# Altium schematic sheet STM32.SchDoc
size A4
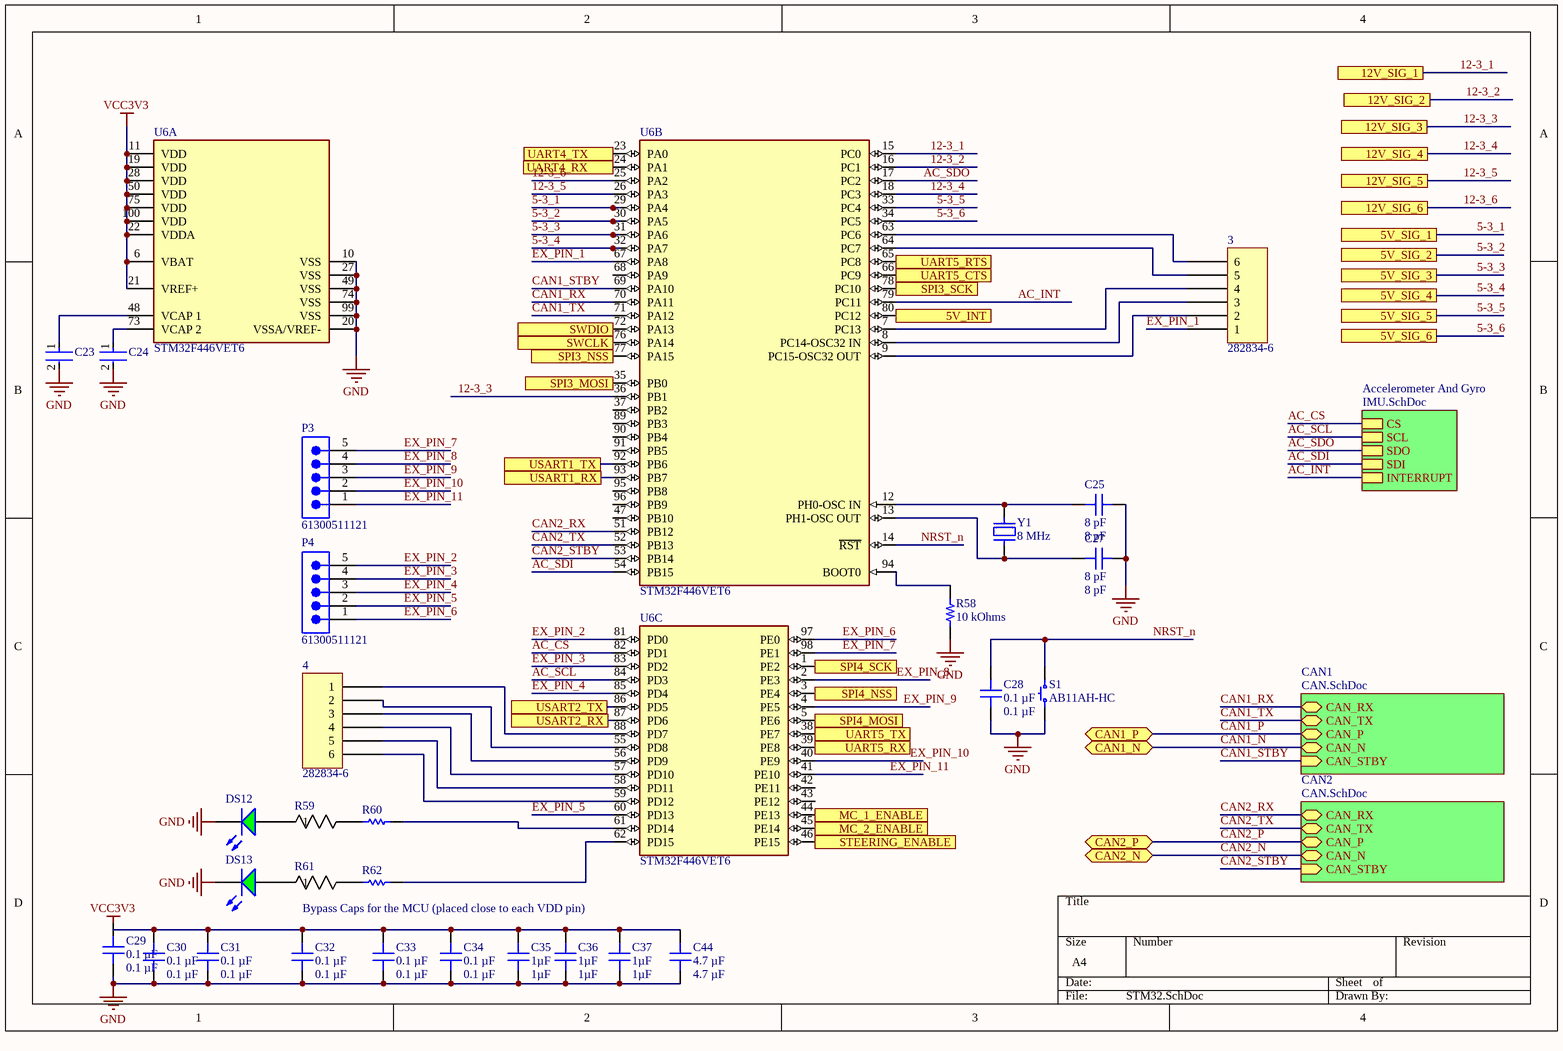
[diagram p0: STM32.SchDoc]

## Parts
3  282834-6  [TE 282834-6]
4  282834-6  [TE 282834-6]
C23  GRM188R71A225KE15D  [FP-GRM188-0_1-e0_2_0_5-MFG]  (value not drawn)
C24  GRM188R71A225KE15D  [FP-GRM188-0_1-e0_2_0_5-MFG]  (value not drawn)
C25  8 pF  [CAP 0805_2012]
C27  8 pF  [CAP 0805_2012]
C28  0.1 µF  [CAP 0805_2012]
C29  0.1 µF  [CAP 0805_2012]
C30  0.1 µF  [CAP 0805_2012]
C31  0.1 µF  [CAP 0805_2012]
C32  0.1 µF  [CAP 0805_2012]
C33  0.1 µF  [CAP 0805_2012]
C34  0.1 µF  [CAP 0805_2012]
C35  1µF  [CAP 0805_2012]
C36  1µF  [CAP 0805_2012]
C37  1µF  [CAP 0805_2012]
C44  4.7 µF  [CAP 0805_2012]
DS12  HLMP-4740  [AVAG-HLMP-4740]  (value not drawn)
DS13  HLMP-4740  [AVAG-HLMP-4740]  (value not drawn)
P3  61300511121  [61300511121]
P4  61300511121  [61300511121]
R58  10 kOhms  [RES 0805_2012]
R59  AC01000005000JA100  [RES_AC01_VIS]  (value not drawn)
R60  RC0805FR-071KL  [RESC2013X60X35ML10T20]  (value not drawn)
R61  AC01000005000JA100  [RES_AC01_VIS]  (value not drawn)
R62  RC0805FR-071KL  [RESC2013X60X35ML10T20]  (value not drawn)
S1  AB11AH-HC  [NKK AB11AH-HC]
U6  STM32F446VET6  [FP-LQFP100-1L-MFG]  (parts A,B,C of 3)
Y1  8 MHz  [ABRACON ABLS]

## Sub-sheets
Accelerometer And Gyro = IMU.SchDoc: CS, SCL, SDO, SDI, INTERRUPT
CAN1 = CAN.SchDoc: CAN_RX (bidir), CAN_TX (bidir), CAN_STBY (in), CAN_P (bidir), CAN_N (bidir)
CAN2 = CAN.SchDoc: CAN_RX (bidir), CAN_TX (bidir), CAN_STBY (in), CAN_P (bidir), CAN_N (bidir)

## Ports
5V_INT, 5V_SIG_1, 5V_SIG_2, 5V_SIG_3, 5V_SIG_4, 5V_SIG_5, 5V_SIG_6, 12V_SIG_1, 12V_SIG_2, 12V_SIG_3, 12V_SIG_4, 12V_SIG_5, 12V_SIG_6, CAN1_N (bidir), CAN1_P (bidir), CAN2_N (bidir), CAN2_P (bidir), MC_1_ENABLE, MC_2_ENABLE, SPI3_MOSI, SPI3_NSS, SPI3_SCK, SPI4_MOSI, SPI4_NSS, SPI4_SCK, STEERING_ENABLE, SWCLK, SWDIO, UART4_RX, UART4_TX, UART5_CTS, UART5_RTS, UART5_RX, UART5_TX, USART1_RX, USART1_TX, USART2_RX, USART2_TX

## Nets
GND: C23.2 C24.2 C25.2 C27.2 C28.1 C29.1 C30.1 C31.1 C32.1 C33.1 C34.1 C35.1 C36.1 C37.1 C44.1 DS12.2(K) DS13.2(K) R58.1 S1.1 U6.10(VSS) U6.20(VSSA/VREF-) U6.27(VSS) U6.49(VSS) U6.74(VSS) U6.99(VSS)
VCC3V3: C30.2 C31.2 C32.2 C33.2 C34.2 C35.2 C36.2 C37.2 C44.2 U6.6(VBAT) U6.11(VDD) U6.19(VDD) U6.21(VREF+) U6.22(VDDA) U6.28(VDD) U6.50(VDD) U6.75(VDD) U6.100(VDD)
5-3_1: U6.29(PA4) ; port 5V_SIG_1
5-3_2: U6.30(PA5) ; port 5V_SIG_2
5-3_3: U6.31(PA6) ; port 5V_SIG_3
5-3_4: U6.32(PA7) ; port 5V_SIG_4
5-3_5: U6.33(PC4) ; port 5V_SIG_5
5-3_6: U6.34(PC5) ; port 5V_SIG_6
5V_INT: U6.80(PC12) ; port 5V_INT
12-3_1: U6.15(PC0) ; port 12V_SIG_1
12-3_2: U6.16(PC1) ; port 12V_SIG_2
12-3_3: U6.36(PB1) ; port 12V_SIG_3
12-3_4: U6.18(PC3) ; port 12V_SIG_4
12-3_5: U6.26(PA3) ; port 12V_SIG_5
12-3_6: U6.25(PA2) ; port 12V_SIG_6
AC_CS: U6.82(PD1) ; sheet Accelerometer And Gyro/CS
AC_INT: U6.79(PC11) ; sheet Accelerometer And Gyro/INTERRUPT
AC_SCL: U6.84(PD3) ; sheet Accelerometer And Gyro/SCL
AC_SDI: U6.54(PB15) ; sheet Accelerometer And Gyro/SDI
AC_SDO: U6.17(PC2) ; sheet Accelerometer And Gyro/SDO
CAN1_N: port CAN1_N, sheet CAN1/CAN_N
CAN1_P: port CAN1_P, sheet CAN1/CAN_P
CAN1_RX: U6.70(PA11) ; sheet CAN1/CAN_RX
CAN1_STBY: U6.69(PA10) ; sheet CAN1/CAN_STBY
CAN1_TX: U6.71(PA12) ; sheet CAN1/CAN_TX
CAN2_N: port CAN2_N, sheet CAN2/CAN_N
CAN2_P: port CAN2_P, sheet CAN2/CAN_P
CAN2_RX: U6.51(PB12) ; sheet CAN2/CAN_RX
CAN2_STBY: U6.53(PB14) ; sheet CAN2/CAN_STBY
CAN2_TX: U6.52(PB13) ; sheet CAN2/CAN_TX
EX_PIN_1: 3.1 U6.67(PA8)
EX_PIN_2: P4.5 U6.81(PD0)
EX_PIN_3: P4.4 U6.83(PD2)
EX_PIN_4: P4.3 U6.85(PD4)
EX_PIN_5: P4.2 U6.60(PD13)
EX_PIN_6: P4.1 U6.97(PE0)
EX_PIN_7: P3.5 U6.98(PE1)
EX_PIN_8: P3.4 U6.2(PE3)
EX_PIN_9: P3.3 U6.4(PE5)
EX_PIN_10: P3.2 U6.40(PE9)
EX_PIN_11: P3.1 U6.41(PE10)
MC_1_ENABLE: U6.44(PE13) ; port MC_1_ENABLE
MC_2_ENABLE: U6.45(PE14) ; port MC_2_ENABLE
NRST_n: C28.2 S1.2 U6.14(~{RST})
SPI3_MOSI: U6.35(PB0) ; port SPI3_MOSI
SPI3_NSS: U6.77(PA15) ; port SPI3_NSS
SPI3_SCK: U6.78(PC10) ; port SPI3_SCK
SPI4_MOSI: U6.5(PE6) ; port SPI4_MOSI
SPI4_NSS: U6.3(PE4) ; port SPI4_NSS
SPI4_SCK: U6.1(PE2) ; port SPI4_SCK
STEERING_ENABLE: U6.46(PE15) ; port STEERING_ENABLE
SWCLK: U6.76(PA14) ; port SWCLK
SWDIO: U6.72(PA13) ; port SWDIO
UART4_RX: U6.24(PA1) ; port UART4_RX
UART4_TX: U6.23(PA0) ; port UART4_TX
UART5_CTS: U6.66(PC9) ; port UART5_CTS
UART5_RTS: U6.65(PC8) ; port UART5_RTS
UART5_RX: U6.39(PE8) ; port UART5_RX
UART5_TX: U6.38(PE7) ; port UART5_TX
USART1_RX: U6.93(PB7) ; port USART1_RX
USART1_TX: U6.92(PB6) ; port USART1_TX
USART2_RX: U6.87(PD6) ; port USART2_RX
USART2_TX: U6.86(PD5) ; port USART2_TX
Net3_2: 3.2 U6.9(PC15-OSC32_OUT)
Net3_3: 3.3 U6.8(PC14-OSC32_IN)
Net3_4: 3.4 U6.7(PC13)
Net3_5: 3.5 U6.64(PC7)
Net3_6: 3.6 U6.63(PC6)
Net4_1: 4.1 U6.88(PD7)
Net4_2: 4.2 U6.55(PD8)
Net4_3: 4.3 U6.56(PD9)
Net4_4: 4.4 U6.57(PD10)
Net4_5: 4.5 U6.58(PD11)
Net4_6: 4.6 U6.59(PD12)
NetC23_1: C23.1 U6.48(VCAP_1)
NetC24_1: C24.1 U6.73(VCAP_2)
NetC25_1: C25.1 U6.12(PH0-OSC_IN) Y1.2
NetC27_1: C27.1 U6.13(PH1-OSC_OUT) Y1.1
NetDS12_1: DS12.1(A) R59.1
NetDS13_1: DS13.1(A) R61.1
NetR58_2: R58.2 U6.94(BOOT0)
NetR59_2: R59.2 R60.1
NetR60_2: R60.2 U6.61(PD14)
NetR61_2: R61.2 R62.1
NetR62_2: R62.2 U6.62(PD15)

Not connected (* = marked no-connect by the designer): C29 2; U6 37(PB2) 42(PE11) 43(PE12) 47(PB10) 68(PA9) 89(PB3) 90(PB4) 91(PB5) 95(PB8) 96(PB9)

## Notes on the sheet
- Bypass Caps for the MCU (placed close to each VDD pin)

## Library data of the parts
3 4 = 282834-6: TERM BLK 6P SIDE ENT 2.54MM PCB; Manufacturer: TE Connectivity AMP Connectors; Current: 10A; Mating Orientation: Horizontal with Board; Number of Levels: 1; Pitch: 0.100" (2.54mm); Positions Per Level: 6; Voltage: 150V; Wire Gauge: 16-30 AWG; Wire Termination: Screw - Rising Cage Clamp; Part Number: 282834-6; Color: Green; ComponentLink1Description: Datasheet; ComponentLink1URL: https://www.te.com/commerce/DocumentDelivery/DDEController?Action=srchrtrv&DocNm=282834&DocType=Customer+Drawing&DocLang=English; ComponentLink2Description: DigiKey Link; ComponentLink2URL: http://digikey.com/product-detail/en/te-connectivity-amp-connectors/282834-6/A98337-ND/1153267; LastUpdated: 2020-01-15 4:16:31 AM; Lifecycle Status: Active; Minimum Order: 1; Mounting Type: Through Hole; Packaging: Bulk; Part Status: Active; Price: 4.72; Series: Buchanan; Supplier 1: DigiKey; Supplier Part Number 1: A98337-ND
C23 C24 = CMP-2006-02836-2: Chip Multilayer Ceramic Capacitors for General Purpose, 0603, 2.2uF, X7R, 15%, 10%, 10V; Case Code (Metric): 1608; Height: 0.8mm; Packaging: Cut Tape; Voltage: 10V; Lead Free: Lead Free; Min Operating Temperature: -55°C; Voltage Rating (DC): 10V; Max Operating Temperature: 125°C; Voltage Rating: 10V; Dielectric: X7R; Depth: 0.8mm; Case Code (Imperial): 0603; Termination: SMD/SMT; Case/Package: 0603; Number of Pins: 2; REACH SVHC: No SVHC; Mount: Surface Mount; Width: 0.031inch; Material: Ceramic; Capacitance: 2.2uF; Package Quantity: 1; Weight: 7.1E-05oz; Length: 1.6mm; Thickness: 0.035inch; Tolerance: 10%
C25 C27 = CBR08C809CAGAC: CAP CER 8PF 250V C0G/NP0 0805; Part Number: CBR08C809CAGAC; Value: 8 pF
C28-C34 = CC0805MRX7R9BB104: CAP CER 0.1UF 50V X7R 0805; Part Number: CC0805MRX7R9BB104; Value: 0.1 µF
C35-C37 = MM05ZC105KCZ2A: CAP CER 1UF 10V X7R 0805; Part Number: MM05ZC105KCZ2A; Value: 1µF
C44 = C0805X475J9RACAUTO: CAP CER 4.7UF 6.3V X7R 0805; Part Number: C0805X475J9RACAUTO; Value: 4.7 µF
DS12 DS13 = CMP-2000-06413-1: T-1 3/4 (5 mm) Low Current LED Lamp, Green, 1.9 V, -20 to 100 degC, 2-Pin THD, RoHS, Bulk; Manufacturer: AvagoTechnologies; Type: Uni-Color; Peak Wavelength: 565nm; Rad Hard: No; Viewing Angle: 50°; Dominant Wavelength/Color Temperature: 569nm; Number of LEDs: 1; Lens Appearance: ColoredDiffused; Lens Shape Type: Circular; Mounting Orientation: TopMount; Intensity: 2.3mcd; Datasheet Version: 07/2014; Category: LEDs; Datasheet URL: http://docs.avagotech.com/docs/AV02-1557EN; Packaging: Bulk; Pin Count: 2; Mounting Technology: ThroughHole; Package Reference: HLMP-4740; Mounting: ThroughHole; Manufacturer URL: http://www.avagotech.com/; Color: Green; Package: 2T-13/4; Package Description: 2-Pin Through Hole Device, Dia 5.845 mm, Pitch 2.54 mm
P3 P4 = CMP-1502-01068-2: NexarPartId: 32855526; Operating Supply Voltage: 250V; Number of Contacts: 5; Connector Type: Male Pin; Current Rating: 3A; Contact Resistance: 20mΩ; Pitch: 2.54mm; Gender: Male; Termination: Solder; RoHS: Compliant; Lead Pitch: 2.54mm; Contact Mating Length: 5.9944mm; Number of Positions: 5; Lead Free: Lead Free; Contact Plating: Gold; Number of Pins: 5; Min Operating Temperature: -40°C; Voltage Rating: 250V; Color: Black; Mount: Through Hole; REACH SVHC: Unknown; Packaging: Bulk; Height: 8.89mm; Number of Rows: 1; Orientation: Vertical; Contact Material: Copper; Max Operating Temperature: 105°C
R58 = RNCS0805BKE10K0: RES 10K OHM 0.1% 1/10W 0805; Manufacturer: Stackpole Electronics Inc; Power (Watts): 0.1W, 1/10W; Temperature Coefficient: ±25ppm/°C; Part Number: RNCS0805BKE10K0; Value: 10 kOhms; ComponentLink1Description: Datasheet; ComponentLink1URL: https://www.seielect.com/catalog/sei-rncs_rnch.pdf; ComponentLink2Description: DigiKey Link; ComponentLink2URL: https://www.digikey.com/en/products/detail/stackpole-electronics-inc/RNCS0805BKE10K0/1800067; Composition: Thin Film; Device Package: 0805 (2012 Metric); Features: Anti-Corrosive, Automotive AEC-Q200, Moisture Resistant; Height - Seated (Max): 0.026" (0.65mm); LastUpdated: 2023-10-12 7:56:55 PM; Lifecycle Status: Active; Minimum Order: 1; Number of Terminations: 2; Operating Temperature: -55°C ~ 155°C; Package / Case: 0805 (2012 Metric); Packaging: TapeAndReel; PartId: 27713; Part Status: Active; Price: 0.07; Ratings: AEC-Q200; Resistance: 10 kOhms; Series: RNCS; Size / Dimension: 0.079" L x 0.049" W (2.00mm x 1.25mm); Supplier 1: DigiKey; Supplier Part Number 1: RNCS0805BKE10K0CT-ND; Supplier Device Package: 0805; Tolerance: ±0.1%
R59 R61 = CMP-00030-39746512-1: AC01000005000JA100 Res Wirewound 500 Ohm 5% 1W 100ppm/°C to 180ppm/°C Conformal AXL Thru-Hole Ammo Pack; Voltage Rating (DC): 22V; Lead Diameter: 800µm; Resistance: 500Ω; Weight: 519.986953mg; Number of Pins: 2; Min Operating Temperature: -40°C; Case/Package: Axial; Schedule B: 8533210080, 8533210080; Features: Flame Retardant Coating; Power Rating: 1W; Max Power Dissipation: 1W; Packaging: Tape & Box (TB); RoHS: Compliant; REACH SVHC: Unknown; NexarPartId: 39746512; Temperature Coefficient: 180ppm/°C; Diameter: 4.3mm; Contact Plating: Tin; Radiation Hardening: No; Max Operating Temperature: 275°C; Length: 11mm; Tolerance: 5%; Composition: Wirewound; Number of Terminations: 2; Termination: Axial; Voltage Rating: 22V
R60 R62 = CMP-2100-03671-1: Chip Resistor, 1 KOhm, +/- 1%, 125 mW, -55 to 155 degC, 0805 (2012 Metric), RoHS, Tape and Reel; Manufacturer: Yageo; Temperature Coefficient: 100ppm/degreesC; Voltage Rating (DC): 150V; Max Power Dissipation: 125mW; Resistance: 1KOhm; Number of Pins: 2; Number of Terminations: 2; Datasheet URL: http://www.yageo.com/NewPortal/yageodocoutput?fileName=/pdf/R-Chip/PYu-RC_Group_51_RoHS_L_5.pdf; Length: 0.079inch; Package Description: 2-Pin Surface Mounted Device, Body 2 x 1.25 mm; Depth: 1.25mm; Height: 0.024inch; Military Standard: Not; Case/Package: 0805; Package Reference: 0805; RoHSCompliant: true; Lead Free: LeadFree; Packaging: TapeandReel; Package Quantity: 1; Datasheet Version: Rev. 5, 10/2016; Tolerance: 1%; Min Operating Temperature: -55degC; Voltage Rating: 150V; Composition: ThickFilm; Case Code (Imperial): 0805; Power Rating: 125mW; Width: 0.049inch; Case Code (Metric): 2012; Manufacturer URL: http://www.yageo.com/; Max Operating Temperature: 155degC; REACH SVHC: Unknown; Termination: SMD/SMT
S1 = AB11AH-HC: SWITCH PUSH SPST-NO 0.4VA 28V; Manufacturer: NKK Switches; Actuator Type: Round, Button; Color - Actuator/Cap: Red; Current Rating (Amps): 0.4VA (AC/DC); Switch Function: Off-Mom; Part Number: AB11AH-HC; Circuit: SPST-NO; ComponentLink1Description: Datasheet; ComponentLink1URL: https://www.nkkswitches.com/pdf/Apushbuttons.pdf; ComponentLink2Description: DigiKey Link; ComponentLink2URL: http://digikey.com/product-detail/en/nkk-switches/AB11AH-HC/360-2604-ND/1056046; Features: Sealed - Fully; LastUpdated: 2020-01-25 8:05:42 PM; Lifecycle Status: Active; Minimum Order: 1; Mounting Type: Through Hole, Right Angle; Operating Temperature: -30°C ~ 85°C; Packaging: Tray; Part Status: Active; Price: 5.00; Series: AB; Supplier 1: DigiKey; Supplier Part Number 1: 360-2604-ND; Termination Style: PC Pin; Type: Standard; Voltage Rating - AC: 28V; Voltage Rating - DC: 28V
U6 = CMP-12105-000075-1: IC MCU 32BIT 512KB FLASH 100LQFP; Manufacturer: STMicroelectronics; Ram Size: 128KBytes; Data Bus Width: 32bits; Max Junction Temp: +125°C; Number Of Adc Channels: 16; Max Supply Voltage: 3.6V; Nominal Supply Current: 1.4-86mA; Number Of Uart Channels: 6; Core Architecture: ARM Cortex-M4; Standoff Height: 0.05mm; Number Of A/D Converters: 3; Frequency: 180MHz; Number Of Cores: 1; Min Supply Voltage: 1.65V; Number Of Timers/Counters: 14; Number Of Usb Channels: 2; Number Of Spi Channels: 4; Interface: I2C,SPI,UART,USART,Parallel,CAN,USB,LIN,IrDA,I2S,Other; Memory Size: 512KBytes; Number Of I/Os: 81; Ambient Temperature Range High: +85°C; Mouser Description: ARM Microcontrollers - MCU High-performance and DSP with FPU, ARM Cortex-M4 MCU with 512 Kbytes Flash, 180 MHz CPU, Art Accelerator, SDRAM; Device Class L2: Embedded Processors and Controllers; Temperature Range Low: -40°C; Device Class L1: Integrated Circuits (ICs); RoHS: TRUE; Ipc Land Pattern Name: QFP50P1600X1600X160-100; Manufacturer Part Number: STM32F446VET6; Octopart: https://octopart.com/stm32f446vet6-stmicroelectronics-52642922; Package: LQFP100-1L; Automotive: No; Category: IC; ComponentLink2URL: https://www.st.com/resource/en/datasheet/stm32f446ve.pdf; Digikey Description: IC MCU 32BIT 512KB FLASH 100LQFP; Temperature Range High: +85°C; Memory Type: FLASH; Lead Free: Yes; Height: 1.6mm; ComponentLink2Description: Datasheet; Number Of I2C Channels: 4; Device Class L3: Microcontrollers; Temperature: -40°C to +85°C; Ambient Temperature Range Low: -40°C
Y1 = ABLS-8.000MHZ-SD7Y-T: CRYSTAL 8.0000MHZ 18PF SMD; Manufacturer: Abracon LLC; ESR (Equivalent Series Resistance): 80 Ohms; Frequency Stability: ±30ppm; Frequency Tolerance: ±15ppm; Operating Mode: Fundamental; Part Number: ABLS-8.000MHZ-SD7Y-T; ComponentLink1Description: Datasheet; ComponentLink1URL: https://abracon.com/Resonators/abls.pdf; ComponentLink2Description: DigiKey Link; ComponentLink2URL: https://www.digikey.com/en/products/detail/abracon-llc/ABLS-8-000MHZ-SD7Y-T/8581989; Frequency: 8 MHz; Height - Seated (Max): 0.165" (4.20mm); LastUpdated: 2023-10-12 8:28:08 PM; Lifecycle Status: Active; Load Capacitance: 18pF; Minimum Order: 1; Mounting Type: Surface Mount; Operating Temperature: -40°C ~ 85°C; Package / Case: HC-49/US; Packaging: CutTape; PartId: 25; Part Status: Active; Price: 0.27; Series: ABLS; Size / Dimension: 0.449" L x 0.185" W (11.40mm x 4.70mm); Supplier 1: DigiKey; Supplier Part Number 1: 535-14365-2-ND; Type: MHz Crystal; Value: 8 MHz